# Altium schematic sheet 24V_DCDC_Conv.SchDoc
size A; SheetNumber: 13; SheetTotal: 15
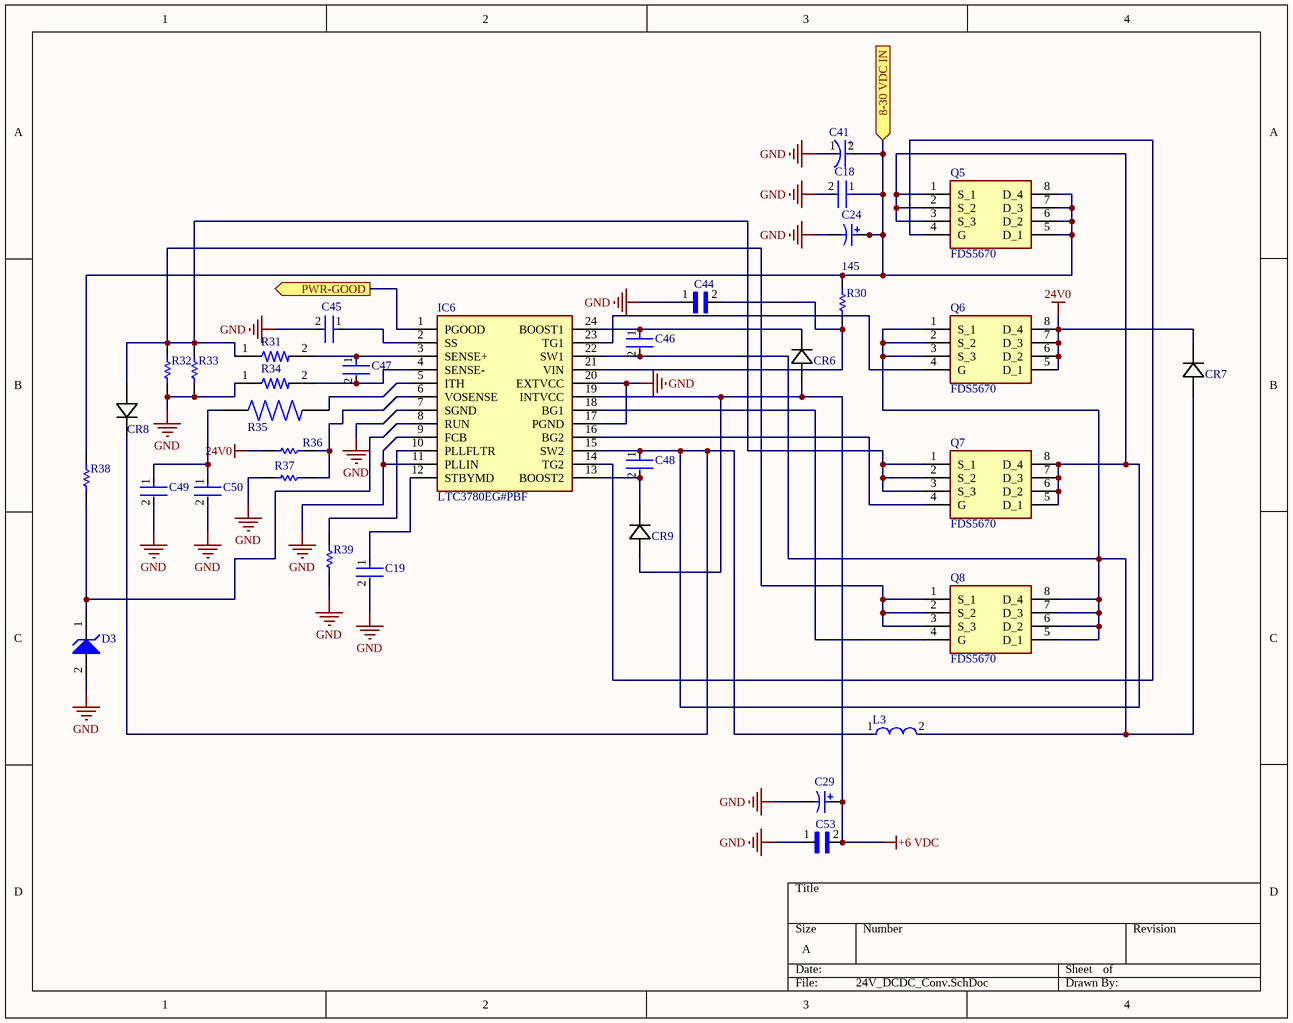
[diagram p0: 24V_DCDC_Conv.SchDoc]

## Parts
C18  C0603C104K5RACTU  [FP-C0603C-CF-IPC_A]  (value not drawn)
C19  C0603C104K5RACTU  [FP-C0603C-CF-IPC_A]  (value not drawn)
C24  Stock 1: 145  [NIC-CAPA2-5X5.8_V]  (hidden comment: UUD1V220MCL1GS)
C29  UUD1V4R7MCL1GS  [NIC-CAPA2-4X5.8_V]  (value not drawn)
C41  EEE-HA1E221UP  [FP-HAF-MFG]  (value not drawn)
C44  C0805C104M5UACTU  [CAPC2012X88N]  (value not drawn)
C45  CC0805KRX7R9BB223  [FP-CC0805-0_85-IPC_C]  (value not drawn)
C46  C0805C224K5RACTU  [FP-C0805C-DN-IPC_A]  (value not drawn)
C47  C1206C680J5GACTU  [FP-C1206C-EB-MFG]  (value not drawn)
C48  C0805C224K5RACTU  [FP-C0805C-DN-MFG]  (value not drawn)
C49  C1206C470J5GACTU  [FP-C1206C-EB-MFG]  (value not drawn)
C50  CC0603KRX7R9BB103  [FP-CC0603-DA-IPC_B]  (value not drawn)
C53  C0805C104M5UACTU  [CAPC2012X88N]  (value not drawn)
CR6  SS34-E3/9AT  [CR_3/9AT_VIS]  (value not drawn)
CR7  SS34-E3/9AT  [CR_3/9AT_VIS]  (value not drawn)
CR8  SS34-E3/9AT  [CR_3/9AT_VIS]  (value not drawn)
CR9  SS34-E3/9AT  [CR_3/9AT_VIS]  (value not drawn)
D3  MMSZ4689T1G  [ONSC-SOD-123-2-425-04_V]  (value not drawn)
IC6  LTC3780EG#PBF  [SOP65P780X200-24N]
L3  IHLP5050CEER4R7M01  [FP-IHLP-5050CE-FP_3_175x3-MFG]  (value not drawn)
Q5  FDS5670  [SOIC127P600X175-8N]
Q6  FDS5670  [SOIC127P600X175-8N]
Q7  FDS5670  [SOIC127P600X175-8N]
Q8  FDS5670  [SOIC127P600X175-8N]
R30  ERJ3EKF1002V  [RESC1609X55X30LL15T15]  (value not drawn)
R31  CRGS0805J100R  [RESC2012X65N]  (value not drawn)
R32  ERJ8BWFR018V  [RESC3216X70X50NL05T20]  (value not drawn)
R33  ERJ8BWFR018V  [RESC3216X70X50NL05T20]  (value not drawn)
R34  CRGS0805J100R  [RESC2012X65N]  (value not drawn)
R35  RC1206JR-07100KL  [RESC3116X65N]  (value not drawn)
R36  CRCW1206294KFKEA  [RESC3216X60X45ML10T20]  (value not drawn)
R37  ERJ3EKF1002V  [RESC1609X55X30LL15T15]  (value not drawn)
R38  ERJ3EKF1002V  [RESC1609X55X30LL15T15]  (value not drawn)
R39  ERJ3EKF1002V  [RESC1609X55X30LL15T15]  (value not drawn)

## Ports
8-30 VDC IN (in), PWR-GOOD (out)

## Nets
24V0: CR7.2(ANODE) Q6.5(D_1) Q6.6(D_2) Q6.7(D_3) Q6.8(D_4) R36.2
+6 VDC: C29.1 C53.2 CR6.1(CATHODE) CR9.1(CATHODE) IC6.19(INTVCC)
GND: C18.2 C19.2 C24.2 C29.2 C41.1(C) C44.1 C45.2 C49.2 C50.2 C53.1 D3.2(A) IC6.7(SGND) IC6.9(FCB) IC6.11(PLLIN) IC6.17(PGND) IC6.20(EXTVCC) R32.2 R33.2 R34.1 R37.1 R39.2
8-30 VDC IN: C18.1 C24.1 C41.2(A) Q5.5(D_1) Q5.6(D_2) Q5.7(D_3) Q5.8(D_4) R30.1 R38.1 ; port 8-30 VDC IN
PWR-GOOD: IC6.1(PGOOD) ; port PWR-GOOD
NetC19_1: C19.1 IC6.12(STBYMD)
NetC44_2: C44.2 IC6.21(VIN) R30.2
NetC45_1: C45.1 IC6.2(SS)
NetC46_1: C46.1 CR6.2(ANODE) IC6.24(BOOST1)
NetC46_2: C46.2 CR7.1(CATHODE) IC6.22(SW1) L3.2 Q6.1(S_1) Q6.2(S_2) Q6.3(S_3) Q8.5(D_1) Q8.6(D_2) Q8.7(D_3) Q8.8(D_4)
NetC47_1: C47.1 IC6.3(SENSE+) R31.2
NetC47_2: C47.2 IC6.4(SENSE-) R34.2
NetC48_1: C48.1 CR8.2(ANODE) IC6.15(SW2) L3.1 Q5.1(S_1) Q5.2(S_2) Q5.3(S_3) Q7.5(D_1) Q7.6(D_2) Q7.7(D_3) Q7.8(D_4)
NetC48_2: C48.2 CR9.2(ANODE) IC6.13(BOOST2)
NetC49_1: C49.1 C50.1 R35.2
NetCR8_1: CR8.1(CATHODE) Q7.1(S_1) Q7.2(S_2) Q7.3(S_3) Q8.1(S_1) Q8.2(S_2) Q8.3(S_3) R31.1 R32.1 R33.1
NetD3_1: D3.1(K) IC6.8(RUN) R38.2
NetIC6_5: IC6.5(ITH) R35.1
NetIC6_6: IC6.6(VOSENSE) R36.1 R37.2
NetIC6_10: IC6.10(PLLFLTR) R39.1
NetIC6_14: IC6.14(TG2) Q5.4(G)
NetIC6_16: IC6.16(BG2) Q7.4(G)
NetIC6_18: IC6.18(BG1) Q8.4(G)
NetIC6_23: IC6.23(TG1) Q6.4(G)

## Notes on the sheet
- (in symbol CMP-05427-000013-1) +

## Library data of the parts
C18 C19 = C0603C104K5RACTU: Multilayer Ceramic Capacitors (MLCC) - SMD/SMT 50volts 0.1uF X7R 10%; Manufacturer: KEMET; Voltage Rating (DC): 50V; Capacitance: 100nF; Dissipation Factor: 2.5%; Supplier 1: Digi-Key; Manufacturer Part Number: C0603C104K5RACTU; RoHS: Yes; Category: Ceramic Capacitors; Pricing 1: 1=0.12000, 10=0.08500, 50=0.04620, 100=0.03770, 500=0.02696, 1000=0.02118 (USD); Mount: Surface Mount; Case/Package: 0603; Number of Pins: 2; Case Code (Metric): 1608; Case Code (Imperial): 0603; Dielectric Material: Ceramic; Contact Plating: Tin,Matte; Min Operating Temperature: -55°C; Max Operating Temperature: 125°C; Tolerance: 10%; Voltage Rating: 50V; Packaging: Tape and Reel; Package Quantity: 1; Dielectric: X7R; Termination: SMD/SMT; Voltage: 50V; Series: SMD Comm X7R; Length: 0.063inch; Width: 0.031inch; Height: 0.8mm; Thickness: 0.034inch; Depth: 0.8mm; Lead Pitch: 0.7mm; Radiation Hardening: No; REACH SVHC: No SVHC; RoHS Compliant: Yes; ComponentLink1URL: https://datasheet.ciiva.com/7823/kem-c1002-x7r-smd-7823591.pdf?src-supplier=Element14; ComponentLink1Description: https://datasheet.ciiva.com/7823/kem-c1002-x7r-smd-7823591.pdf?src-supplier=Element14; ComponentLink2URL: https://datasheet.ciiva.com/7823/kem-c1002-x7r-smd-7823592.pdf?src-supplier=Element14; ComponentLink2Description: https://datasheet.ciiva.com/7823/kem-c1002-x7r-smd-7823592.pdf?src-supplier=Element14; ComponentLink3URL: https://datasheet.ciiva.com/5999/kem-c1002-x7r-smd-5999400.pdf?src-supplier=Farnell; ComponentLink3Description: https://datasheet.ciiva.com/5999/kem-c1002-x7r-smd-5999400.pdf?src-supplier=Farnell; ComponentLink4URL: https://datasheet.ciiva.com/28645/1851736-28645640.pdf?src-supplier=Element14; ComponentLink4Description: https://datasheet.ciiva.com/28645/1851736-28645640.pdf?src-supplier=Element14; ComponentLink5URL: https://datasheet.ciiva.com/14585/70095383-14585209.pdf?src-supplier=Allied+Electronics; ComponentLink5Description: https://datasheet.ciiva.com/14585/70095383-14585209.pdf?src-supplier=Allied+Electronics; ComponentLink6URL: https://datasheet.ciiva.com/14602/70095383-14602583.pdf?src-supplier=Allied+Electronics; ComponentLink6Description: https://datasheet.ciiva.com/14602/70095383-14602583.pdf?src-supplier=Allied+Electronics; Supplier Part Number 1: 399-C0603C104K5RAC7867CT-ND; Stock 1: 10133409
C24 = UUD1V220MCL1GS: Aluminum Electrolytic Capacitor, 22uF 35 V, UD Series 2000h 5 (Dia.) x 5.8mm; Manufacturer: Nichicon; Dielectric Material: Aluminium; Tolerance: 20%; Ripple Current: 150mA; Voltage Rating (DC): 35V; Impedance: 760mR; Leakage Current: 3uA; Life (Hours): 2000Hour; Dissipation Factor: 0.12%; Polarity: Polar; Lead Diameter: 0.8mm; Supplier 1: Mouser; Manufacturer Part Number: UUD1V220MCL1GS; RoHS: Yes; Category: Aluminum Electrolytic Capacitors; Pricing 1: 1=0.48000, 10=0.30200, 50=0.30200, 100=0.22000, 1000=0.16500, 10000=0.13800 (USD); Case/Package: Radial; Number of Pins: 2; Min Operating Temperature: -55°C; Max Operating Temperature: 105°C; Capacitance: 22uF; Package Quantity: 1; Ripple Current (AC): 150mA; Packaging: Tape and Reel; Voltage Rating: 35V; Termination: SMD/SMT; Voltage: 35V; Features: General Purpose; Diameter: 5mm; Length: 5.8mm; Height: 5.8mm; Lead Pitch: 1.3mm; Height - Seated (Max): 0.228inch; Radiation Hardening: No; REACH SVHC: No SVHC; Lead Free: Lead Free; RoHS Compliant: Yes; ComponentLink1URL: https://datasheet.ciiva.com/96/e-ch-ta-96798.pdf?src-supplier=Digi-Key; ComponentLink1Description: https://datasheet.ciiva.com/96/e-ch-ta-96798.pdf?src-supplier=Digi-Key; ComponentLink2URL: https://datasheet.ciiva.com/96/e-uud-96799.pdf?src-supplier=Digi-Key; ComponentLink2Description: https://datasheet.ciiva.com/96/e-uud-96799.pdf?src-supplier=Digi-Key; ComponentLink3URL: https://datasheet.ciiva.com/96/e-ch-ref-96800.pdf?src-supplier=Digi-Key; ComponentLink3Description: https://datasheet.ciiva.com/96/e-ch-ref-96800.pdf?src-supplier=Digi-Key; Supplier Part Number 1: 647-UUD1V220MCL
C29 = UUD1V4R7MCL1GS: Cap Aluminum Lytic 4.7uF 35V 20% (4 X 5.8mm) SMD 80mA 2000h 105C Automotive T/R; Manufacturer: Nichicon; Dielectric Material: Aluminium; Leakage Current: 3uA; Life (Hours): 2000Hour; Impedance: 1.8R; Dissipation Factor: 0.12%; Supplier 1: Digi-Key; Manufacturer Part Number: UUD1V4R7MCL1GS; RoHS: Yes; Category: Aluminum Electrolytic Capacitors; Pricing 1: 1=0.51000, 10=0.35600, 50=0.24960, 100=0.21390, 500=0.16042, 1000=0.13547 (USD); Case/Package: Radial; Number of Pins: 2; Min Operating Temperature: -55°C; Max Operating Temperature: 105°C; Tolerance: 20%; Ripple Current: 80mA; Package Quantity: 2000; Voltage Rating (DC): 35V; Packaging: Tape and Reel; Capacitance: 4.7uF; Termination: SMD/SMT; Series: UUD; Voltage Rating: 35V; Construction: Cylindrical; Ripple Current (AC): 80mA; Diameter: 4mm; Length: 5.8mm; Height: 5.8mm; Height - Seated (Max): 0.228inch; Radiation Hardening: No; RoHS Compliant: Yes; Lead Free: Lead Free; REACH SVHC: No SVHC; ComponentLink1URL: https://datasheet.ciiva.com/96/e-ud-96647.pdf?src-supplier=Digi-Key; ComponentLink1Description: https://datasheet.ciiva.com/96/e-ud-96647.pdf?src-supplier=Digi-Key; ComponentLink2URL: https://datasheet.ciiva.com/96/e-ud-96648.pdf?src-supplier=Digi-Key; ComponentLink2Description: https://datasheet.ciiva.com/96/e-ud-96648.pdf?src-supplier=Digi-Key; ComponentLink3URL: https://datasheet.ciiva.com/96/e-ud-96649.pdf?src-supplier=Digi-Key; ComponentLink3Description: https://datasheet.ciiva.com/96/e-ud-96649.pdf?src-supplier=Digi-Key; ComponentLink4URL: https://datasheet.ciiva.com/5360/e-ud-5360520.pdf?src-supplier=Mouser; ComponentLink4Description: https://datasheet.ciiva.com/5360/e-ud-5360520.pdf?src-supplier=Mouser; ComponentLink5URL: https://datasheet.ciiva.com/11687/e-ud-11687388.pdf?src-supplier=Avnet; ComponentLink5Description: https://datasheet.ciiva.com/11687/e-ud-11687388.pdf?src-supplier=Avnet; ComponentLink6URL: https://datasheet.ciiva.com/16383/e-ud-16383407.pdf?src-supplier=Future+Electronics; ComponentLink6Description: https://datasheet.ciiva.com/16383/e-ud-16383407.pdf?src-supplier=Future+Electronics; ComponentLink7URL: https://datasheet.ciiva.com/7793/e-ud-7793429.pdf?src-supplier=Element14; ComponentLink7Description: https://datasheet.ciiva.com/7793/e-ud-7793429.pdf?src-supplier=Element14; ComponentLink8URL: https://datasheet.ciiva.com/17354/e-ud-17354680.pdf?src-supplier=Avnet+Europe; ComponentLink8Description: https://datasheet.ciiva.com/17354/e-ud-17354680.pdf?src-supplier=Avnet+Europe; Supplier Part Number 1: 493-2281-1-ND; Stock 1: 5341
C41 = CMP-05427-000013-1: CAP ALUM 220UF 20% 25V SMD; Manufacturer: Panasonic; Leakage Current: 55uA; Dissipation Factor: 16%; Material: Aluminum; Life: 1000Hours; Ripple Current: 160mA; Temperature Range Low: -40°C; ComponentLink2Description: Datasheet; Automotive: No; Category: Cap; Manufacturer Part Number: EEE-HA1E221UP; Package: HAF; Device Class L3: Aluminum Electrolytic Capacitors; Device Class L1: Passive Components; Voltage: 25V; RoHS: TRUE; Height: 10.5mm; Value: 220uF; Mouser Description: Aluminum Electrolytic Capacitors - SMD 220UF 25V ELECT HA SMD; Lead Free: Yes; Device Class L2: Capacitors; Octopart: https://octopart.com/eee-ha1e221up-panasonic-39481261; Voltage Rating: 25V; Temperature Range High: +105°C; Tolerance: 20%; Temperature: -40°C to +105°C; ComponentLink2URL: https://industrial.panasonic.com/cdbs/www-data/pdf/RDE0000/ABA0000C1151.pdf; Capacitance: 220uF; Digikey Description: CAP ALUM 220UF 20% 25V SMD
C44 C53 = C0805C104M5UACTU: 0.1ÂµF Â±20% 50V Ceramic Capacitor Z5U 0805 _2012 Metric_; MF: KEMET; SnapEDA_Link: https://www.snapeda.com/parts/C0805C104M5UACTU/KEMET/view-part/455200/?ref=snap; Availability: Unavailable; Price: None; Package: 2012 KEMET; Value: *; MP: C0805C104M5UACTU; Supplier 1: Mouser; Supplier Part Number 1: 80-C0805C104Z5V
C45 = CMP-1036-04064-2: CAP CER 0.022UF 50V X7R 0805; Manufacturer: Yageo; Value: 22 nF; Material: Ceramic; Tolerance: 0.1; Temperature Range High: +85°C; Mouser Description: Multilayer Ceramic Capacitors MLCC - SMD/SMT 22nF 50V X7R 10%; Package: CC0805-0.85; Automotive: No; Temperature Characteristic: X7R; ComponentLink2Description: Datasheet; Manufacturer Part Number: CC0805KRX7R9BB223; Capacitance: 22 nF; Ipc Land Pattern Name: CAPC200125X85; Digikey Description: CAP CER 0.022UF 50V X7R 0805; Temperature: -30°C to +85°C; Height: 0.95mm; Temperature Range Low: -30°C; Category: Cap; Voltage Rating: 50 V; Device Class L3: Ceramic Capacitors; Device Class L1: Passive Components; Octopart: https://octopart.com/cc0805krx7r9bb223-yageo-39467761; Lead Free: Yes; Device Class L2: Capacitors; ComponentLink2URL: http://www.yageo.com/documents/recent/UPY-GPHC_Y5V_6.3V-to-50V_8.pdf; RoHS: TRUE; Footprint Url: http://www.yageo.com/exep/pages/download/literatures/UPY-C_GEN_24.pdf
C46 C48 = CMP-1036-04552-2: CAP CER 0.22UF 50V X7R 0805; Manufacturer: KEMET; Value: 0.22 μF; Temperature Coefficient: 30ppm/°C; Material: Ceramic; Tolerance: 0.1; ComponentLink2URL: https://content.kemet.com/datasheets/KEM_C1003_C0G_SMD.pdf; Temperature Characteristic: X7R; Device Class L3: Ceramic Capacitors; Lead Free: Yes; Temperature: -55°C to +125°C; RoHS: TRUE; Capacitance: 0.22 μF; Automotive: No; Octopart: https://octopart.com/c0805c224k5ractu-kemet-144670; Manufacturer Part Number: C0805C224K5RACTU; Temperature Range Low: -55°C; Height: 0.88mm; Device Class L1: Passive Components; Digikey Description: CAP CER 0.22UF 50V X7R 0805; ComponentLink2Description: Datasheet; Mouser Description: CAP CER 0.22UF 50V X7R 0805; Category: Cap; Ipc Land Pattern Name: CAPC200125X78; Temperature Range High: +125°C; Package: C0805C-DN; Device Class L2: Capacitors; Voltage Rating: 50 V
C47 = CMP-03020-008221-1: 1206 C 68pF Ceramic Multilayer Capacitor; 50 VDC; +125degC; C0G Dielec; +/-5%; Manufacturer: KEMET; Tolerance: 0.05; Temperature Coefficient: 15%; Voltage Rating: 50 V; Automotive Grade: Grade 0; Temperature Range High: +150°C; Octopart: https://octopart.com/c1206c680j5gactu-kemet-138975; ComponentLink2Description: Datasheet; ComponentLink2URL: https://content.kemet.com/datasheets/KEM_C1007_X8R_ULTRA_150C_SMD.pdf; Lead Free: Yes; Height: 0.88mm; Category: Cap; Temperature Range Low: -55°C; Temperature Characteristic: C0G; Manufacturer Part Number: C1206C680J5GACTU; Device Class L2: Capacitors; Automotive: Yes; Device Class L1: Passive Components; Digikey Description: 1206 C 68pF Ceramic Multilayer Capacitor; 50 VDC; +125degC; C0G Dielec; +/-5%; RoHS: TRUE; Temperature: -55°C to +150°C; Capacitance: 68 pF; Material: Ceramic; Value: 68 pF; Package: C1206C-EB; Ipc Land Pattern Name: CAPC320160X78; Mouser Description: 1206 C 68pF Ceramic Multilayer Capacitor; 50 VDC; +125degC; C0G Dielec; +/-5%; Device Class L3: Ceramic Capacitors
C49 = CMP-03020-017724-1: CAP CER 47PF 50V C0G/NP0 1206; Manufacturer: KEMET; Temperature Coefficient: 15%; Automotive Grade: Grade 0; Tolerance: 0.05; Temperature Characteristic: C0G; Material: Ceramic; ComponentLink2URL: https://content.kemet.com/datasheets/KEM_C1007_X8R_ULTRA_150C_SMD.pdf; Temperature: -55°C to +150°C; Automotive: Yes; Manufacturer Part Number: C1206C470J5GACTU; RoHS: TRUE; Value: 47 pF; Ipc Land Pattern Name: CAPC320160X78; Voltage Rating: 50 V; Device Class L3: Ceramic Capacitors; Device Class L1: Passive Components; Lead Free: Yes; Device Class L2: Capacitors; ComponentLink2Description: Datasheet; Capacitance: 47 pF; Temperature Range Low: -55°C; Package: C1206C-EB; Height: 0.88mm; Category: Cap; Octopart: https://octopart.com/c1206c470j5gactu-kemet-96509; Temperature Range High: +150°C; Digikey Description: CAP CER 47PF 50V C0G/NP0 1206; Mouser Description: Multilayer Ceramic Capacitors MLCC - SMD/SMT 50volts 47pF C0G 5%
C50 = CMP-2100-03600-2: CAP CER 10000PF 50V X7R 0603; Manufacturer: YAGEO; Tolerance: 0.1; Material: Ceramic; Temperature Coefficient: 15%; Value: 10 nF; Mouser Description: Multilayer Ceramic Capacitor, CC Series, 0.01 - F, - 10%, X7R, 50 V, 0603 [1608 Metric]; Digikey Description: CAP CER 10000PF 50V X7R 0603; Height: 0.9mm; Category: Cap; Temperature Characteristic: X7R; Footprint Url: http://www.yageo.com/exep/pages/download/literatures/UPY-C_GEN_24.pdf; Lead Free: Yes; Voltage Rating: 50 V; Manufacturer Part Number: CC0603KRX7R9BB103; Temperature: -55°C to +125°C; Device Class L3: Ceramic Capacitors; ComponentLink2Description: Datasheet; Voltage: 50 V; Package: CC0603-DA; Octopart: https://octopart.com/cc0603krx7r9bb103-yageo-192938; Automotive: No; Temperature Range High: +125°C; Temperature Range Low: -55°C; RoHS: TRUE; Device Class L1: Passive Components; ComponentLink2URL: http://www.yageo.com/documents/recent/UPY-GPHC_X7R_6.3V-to-50V_18.pdf; Device Class L2: Capacitors; Capacitance: 10 nF
CR6-CR9 = SS34-E3/9AT: No Description Available; Mfr_Name: Vishay; Type: DEV; Copyright: Copyright (C) 2021 Ultra Librarian. All rights reserved.; Manufacturer_Part_Number: SS34-E3/9AT; RefDes: RefDes
D3 = CMP-1060-00416-1: Zener Voltage Regulator, 500 mW, 2-Pin SOD-123, Pb-Free, Tape and Reel; Manufacturer: On Semiconductor; VZ Typ (V): 5.1; P Max (W): 0.5; ComponentLink2URL: http://www.onsemi.com/pub_link/Collateral/MMSZ4678T1-D.PDF; PackageVersion: Rev. G, 10/2009; ComponentLink1Description: Manufacturer URL; PackageDescription: 2-Pin SOD, Body 1.6 x 2.69 mm; PartNumber: MMSZ4689T1G; DatasheetVersion: Rev. 9; PackageReference: SOD-123-2-425-04; RoHS: Pb-Free; Mounting Technology: Surface Mount; ComponentLink3URL: http://www.onsemi.com/pub_link/Collateral/425-04.PDF; ComponentLink2Description: Datasheet; ComponentLink1URL: http://www.onsemi.com/; ComponentLink3Description: Package Specification; Packing: Tape and Reel
IC6 = LTC3780EG#PBF: Integrated Circuit; Manufacturer_Name: Linear Technology; Datasheet Link: https://datasheet.datasheetarchive.com/originals/distributors/Datasheets-SFU1/DSASFU10009110.pdf; Height: 2mm; Manufacturer_Part_Number: LTC3780EG#PBF; Mouser Part Number: 584-LTC3780EG#PBF; Mouser Price/Stock: https://www.mouser.co.uk/ProductDetail/Analog-Devices-Linear-Technology/LTC3780EGPBF?qs=hVkxg5c3xu%252BOBZugU8NO3w%3D%3D; Arrow Part Number: LTC3780EG#PBF; Arrow Price/Stock: https://www.arrow.com/en/products/ltc3780egpbf/linear-technology
L3 = CMP-02424-000578-1: Commercial Inductors, High Saturation Series 4.7uH 10A 15mΩ 20%; Saturation Current: 24A; Core Material: Metal; Shielding: Shielded; DC Resistance (DCR): 15mR; Self Resonant Frequency: 5MHz; Test Frequency: 100kHz; Max Operating Temperature: 125°C; Package Quantity: 500; Termination: SMD/SMT; Inductance Tolerance: 20%; Radiation Hardening: No; Height - Seated (Max): 0.138inch; Lead Free: Lead Free; Width: 0.508inch; Packaging: Tape and Reel; Inductance: 4.7uH; Case/Package: 5050; Length: 13.2mm; Height: 3.5mm; Mount: Surface Mount; Min Operating Temperature: -55°C; Current Rating: 10A; RMS Current (Irms): 10A; Military Standard: Not; Max DC Current: 10A; Tolerance: 20%; Depth: 12.9mm; Number of Pins: 5050
Q5-Q8 = FDS5670: MOSFET (N-Channel); Manufacturer_Name: ON Semiconductor; Datasheet Link: https://eagle.componentsearchengine.com/Datasheets/2/FDS5670.pdf; Height: 1.75mm; Manufacturer_Part_Number: FDS5670; Mouser Part Number: 512-FDS5670; Mouser Price/Stock: https://www.mouser.com/Search/Refine.aspx?Keyword=512-FDS5670; Arrow Part Number: FDS5670; Arrow Price/Stock: https://www.arrow.com/en/products/fds5670/on-semiconductor
R30 R37-R39 = CMP-1012-00623-3: Chip Resistor, 10 KOhm, +/- 1%, 0.1 W, -55 to 155 degC, 0603 (1608 Metric), RoHS, Tape and Reel; Manufacturer: Panasonic; Voltage Rating: 75V; Case\/Package: 0603; Power Rating: 100mW; Resistance: 10KOhm; Temperature Coefficient: 100ppm\/degreesC; Number of Pins: 2; Package Reference: 603; Depth: 0.8mm; Mount: SurfaceMount; Package Description: 2-Pin Surface Mount Device, Body 1.6 x 0.85 mm; Datasheet Version: 02/2017; Length: 1.6mm; Lead Free: LeadFree; Height: 0.45mm; Number of Terminations: 2; Max Power Dissipation: 100mW; Min Operating Temperature: -55degC; Datasheet URL: https://industrial.panasonic.com/cdbs/www-data/pdf/RDA0000/AOA0000C304.pdf; Termination: SMD/SMT; Case Code (Metric): 1608; Case Code (Imperial): 0603; Tolerance: 1%; Max Operating Temperature: 155degC; RoHSCompliant: true; Voltage Rating (DC): 75V; Radiation Hardening: No; Packaging: TapeandReel; Composition: ThickFilm; Mounting Technology: SurfaceMount; Manufacturer URL: http://www.panasonic.com/; Width: 0.031inch; REACH SVHC: NoSVHC; Contact Plating: Tin; Military Standard: Not; Package Quantity: 1
R31 R34 = CRGS0805J100R: 100 Ohms Â±5% 0.5W, 1/2W Chip Resistor 0805 _2012 Metric_ Pulse Withstanding Thick Film; MF: TE Connectivity; TE_purchase_URL: https://www.te.com/usa-en/product-2-2176244-5.html?te_bu=Cor&te_type=disp&te_campaign=seda_glo_cor-seda-global-disp-prtnr-fy19-seda-model-bom-cta_sma-317_1&elqCampaignId=32493; Package: 0805 TE Connectivity; SnapEDA_Link: https://www.snapeda.com/parts/CRGS0805J100R/TE%20Connectivity%20AMP%20Connectors/view-part/1008227/?ref=snap; MP: CRGS0805J100R; Value: *; Availability: Unavailable; Price: None; Supplier 1: Mouser; Supplier Part Number 1: 279-CRGS0805J100R
R32 R33 = CMP-2003-00769-1: Manufacturer: Panasonic; Part Number: ERJ8BWFR018V
R35 = RC1206JR-07100KL: Carbon film resistor 100 kâ„¦ SMD 1206 0.25 W 5 % 200 ppm Yageo RC1206JR-07100KL 1 pc(s); Package: None; Price: None; Value: *; MP: RC1206JR-07100KL; Availability: Unavailable; Supplier 1: Digi-Key; Supplier Part Number 1: 311-100KERCT-ND
R36 = CMP-2003-02025-1: Manufacturer: Vishay Dale; Part Number: CRCW1206294KFKEA